# EAGLE design untitled (EAGLE 6.4)
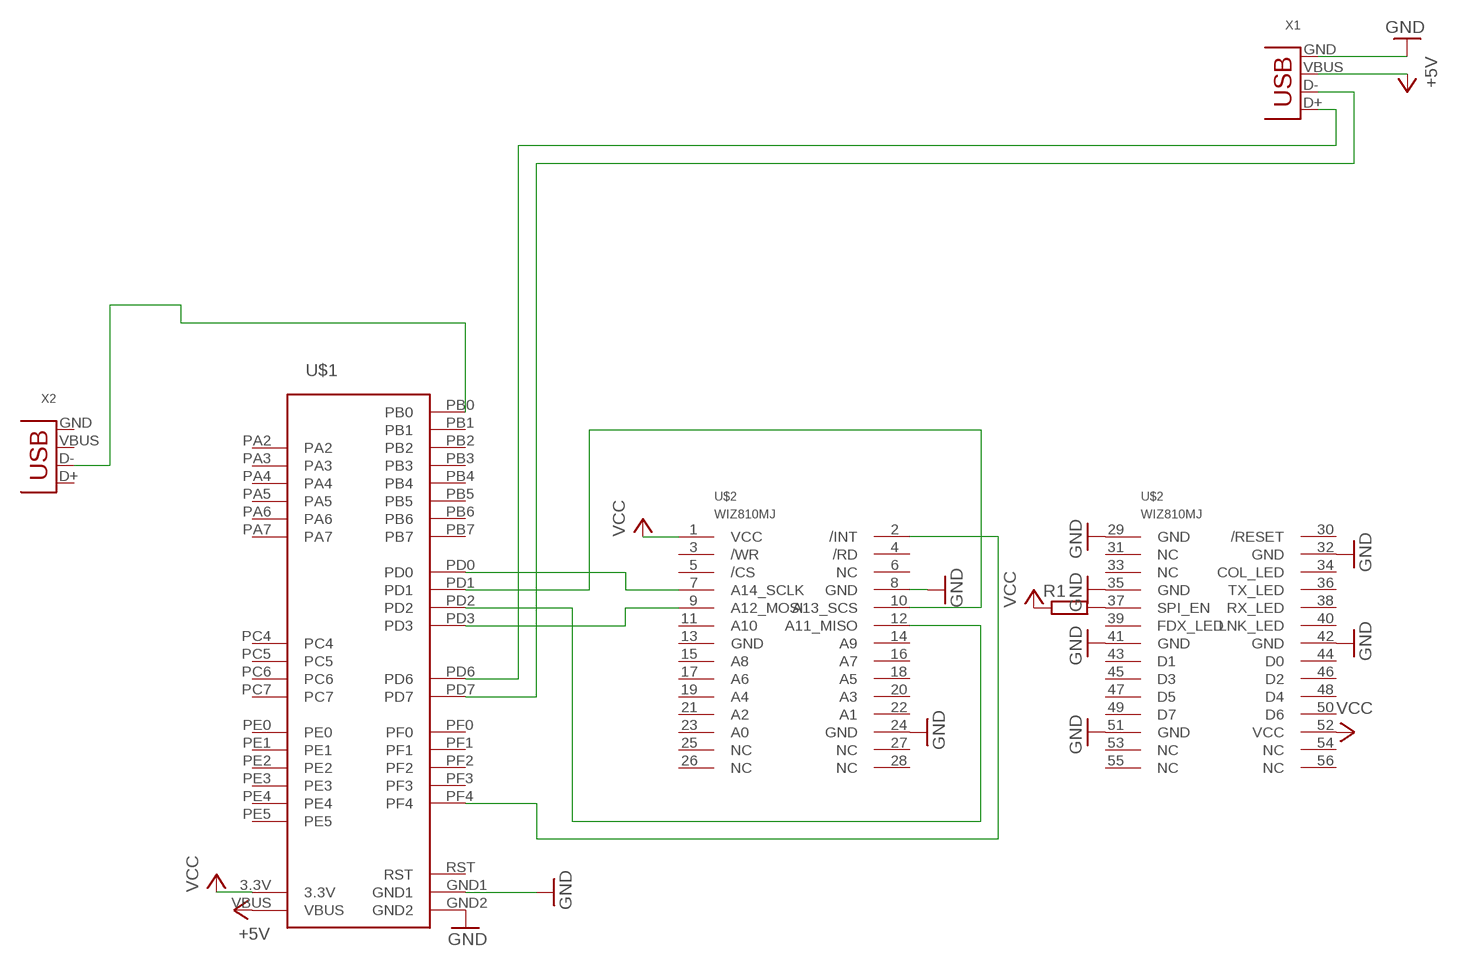
[diagram p0: schematic, sheet 1]

## Parts
R1  R-EU_0204/5  [0204/5]
U$1  STELLARIS-LAUNCHPADSTELLARIS-LAUNCHPAD-XL  [LAUNCHPAD-XL]
U$2  WIZ810MJ  [WIZ810MJ]
X1  USB-A-H  [USB-A-H]
X2  USB-A-H  [USB-A-H]

## Nets
+5V: U$1.VBUS X1.VBUS
GND: U$1.GND1 U$1.GND2 U$2.8(GND) U$2.24(GND) U$2.29(GND) U$2.32(GND) U$2.35(GND) U$2.41(GND) U$2.42(GND) U$2.51(GND) X1.GND
N$1: U$1.PD0 U$2.7(A14_SCLK)
N$2: R1.2 U$2.37(SPI_EN)
N$3: U$1.PD3 U$2.9(A12_MOSI)
N$4: U$1.PD2 U$2.12(A11_MISO)
N$5: U$1.PD1 U$2.10(A13_SCS)
N$6: U$1.PF4 U$2.2(/INT)
N$7: U$1.PD6 X1.D+
N$8: U$1.PD7 X1.D-
N$9: U$1.PB0 X2.D-
VCC: R1.1 U$1.3.3V U$2.1(VCC) U$2.52(VCC)
Unconnected: U$1.PA2 U$1.PA3 U$1.PA4 U$1.PA5 U$1.PA6 U$1.PA7 U$1.PB1 U$1.PB2 U$1.PB3 U$1.PB4 U$1.PB5 U$1.PB6 U$1.PB7 U$1.PC4 U$1.PC5 U$1.PC6 U$1.PC7 U$1.PE0 U$1.PE1 U$1.PE2 U$1.PE3 U$1.PE4 U$1.PE5 U$1.PF0 U$1.PF1 U$1.PF2 U$1.PF3 U$2.3(/WR) U$2.4(/RD) U$2.5(/CS) U$2.6(NC) U$2.11(A10) U$2.13(GND) U$2.14(A9) U$2.15(A8) U$2.16(A7) U$2.17(A6) U$2.18(A5) U$2.19(A4) U$2.20(A3) U$2.21(A2) U$2.22(A1) U$2.23(A0) U$2.25(NC) U$2.26(NC) U$2.27(NC) U$2.28(NC) U$2.30(/RESET) U$2.31(NC) U$2.33(NC) U$2.34(COL_LED) U$2.36(TX_LED) U$2.38(RX_LED) U$2.39(FDX_LED) U$2.40(LNK_LED) U$2.43(D1) U$2.44(D0) U$2.45(D3) U$2.46(D2) U$2.47(D5) U$2.48(D4) U$2.49(D7) U$2.50(D6) U$2.53(NC) U$2.54(NC) U$2.55(NC) U$2.56(NC) X2.D+ X2.GND X2.VBUS

## Power pins joined to a net without a drawn wire
RST: U$1.RST

## Library data of the parts
R1 = resistor:R-EU_: RESISTOR, European symbol
U$1 = StellarisLaunchPad_Fred:STELLARIS-LAUNCHPAD
U$2 = WIZNET:WIZ810MJ
X1 X2 = lieven:USB: USB Connectors

## Board
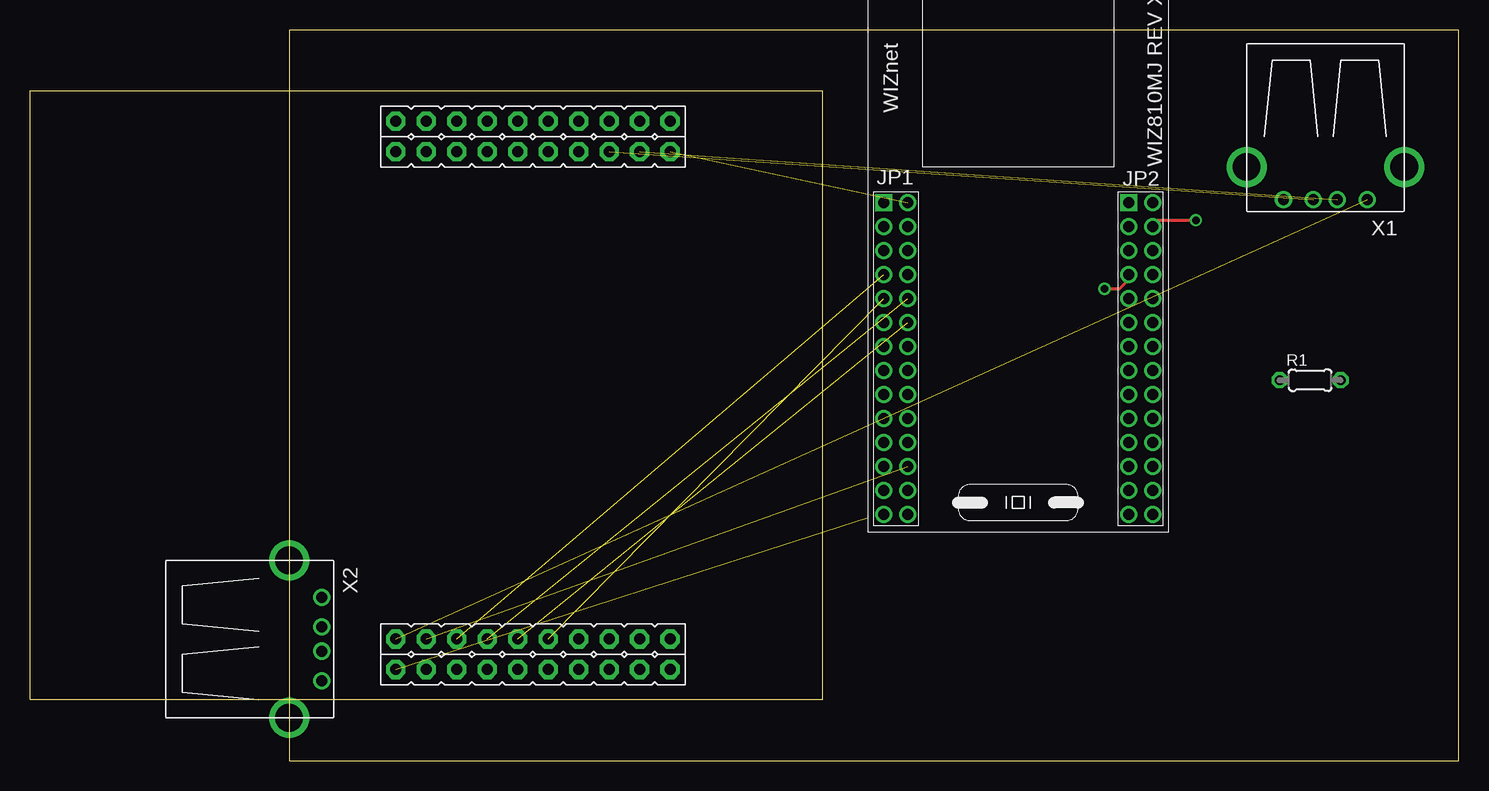
[diagram p1: board, top side]
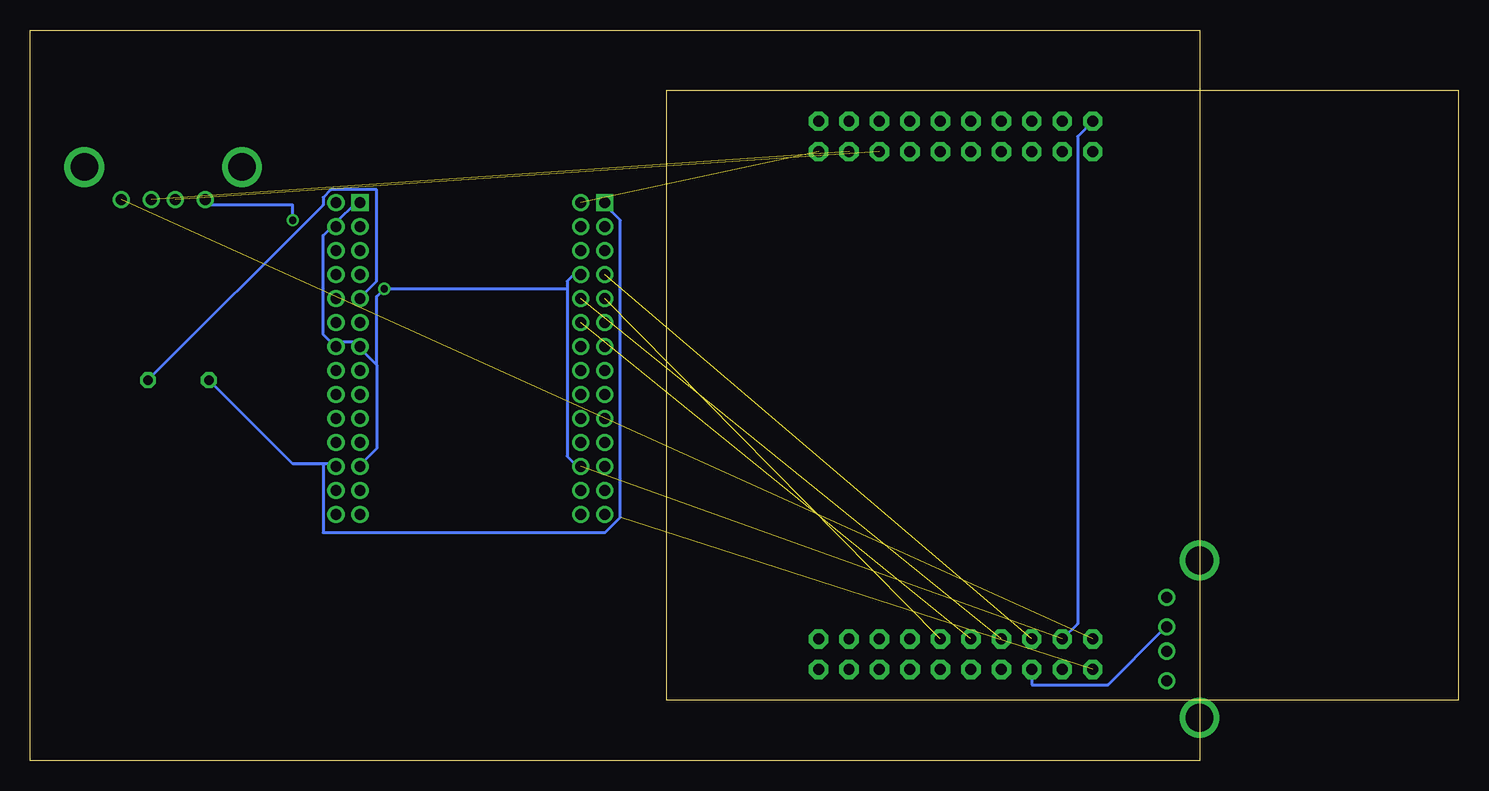
[diagram p2: board, bottom side, seen from below]

Size 97.46 x 60.95 mm. Coordinates in mm from the lower left corner, seen from the top.
Outline: 0,0 97.46,0 97.46,60.95 0,60.95 0,0
Copper layers (1*16): Top 0.035mm / dielectric 1.5mm / Bottom 0.035mm
Design rules "default": minimum track width 10mil, minimum drill 24mil, track to track 8mil, track to pad 8mil, pad to pad 8mil, via to via 8mil, smd to smd 8mil, copper to edge 40mil, drill to drill 8mil, minimum pad ring 10mil, minimum via ring 8mil, stop-mask expansion 4mil, vias tented up to drill 0mil, thermal gap 10mil

### Footprints (pad centres in the part's own frame; a part is rotated, then mirrored left to right if it is on the bottom)
0204/5 = drill 0.813 octagon: 1 -2.54,0; 2 2.54,0
LAUNCHPAD-XL = drill 0.914 pad 1.6 octagon: 3.3V 30.48,2.54; GND1 33.02,5.08; GND2 30.48,48.26; PA2 53.34,48.26; PA3 50.8,48.26; PA4 48.26,48.26; PA5 48.26,2.54; PA6 50.8,2.54; PA7 53.34,2.54; PB0 35.56,2.54; PB1 38.1,2.54; PB2 33.02,48.26; PB3 35.56,45.72; PB4 45.72,2.54; PB5 33.02,2.54; PB6 45.72,48.26; PB7 43.18,48.26; PC4 38.1,45.72; PC5 40.64,45.72; PC6 43.18,45.72; PC7 45.72,45.72; PD0 35.56,5.08; PD1 38.1,5.08; PD2 40.64,5.08; PD3 43.18,5.08; PD6 48.26,45.72; PD7 50.8,45.72; PE0 35.56,48.26; PE1 45.72,5.08; PE2 48.26,5.08; PE3 50.8,5.08; PE4 40.64,2.54; PE5 43.18,2.54; PF0 38.1,48.26; PF1 53.34,5.08; PF2 30.48,45.72; PF3 33.02,45.72; PF4 53.34,45.72; RST 40.64,48.26; VBUS 30.48,5.08
WIZ810MJ = drill 0.9 pad 1.422 square: 1 27.5,-1.3; 29 27.5,-21.7 | drill 0.9 pad 1.422: 2 27.5,-3.3; 3 25.5,-1.3; 4 25.5,-3.3; 5 23.5,-1.3; 6 23.5,-3.3; 7 21.5,-1.3; 8 21.5,-3.3; 9 19.5,-1.3; 10 19.5,-3.3; 11 17.5,-1.3; 12 17.5,-3.3; 13 15.5,-1.3; 14 15.5,-3.3; 15 13.5,-1.3; 16 13.5,-3.3; 17 11.5,-1.3; 18 11.5,-3.3; 19 9.5,-1.3; 20 9.5,-3.3; 21 7.5,-1.3; 22 7.5,-3.3; 23 5.5,-1.3; 24 5.5,-3.3; 25 3.5,-1.3; 26 3.5,-3.3; 27 1.5,-1.3; 28 1.5,-3.3; 30 27.5,-23.7; 31 25.5,-21.7; 32 25.5,-23.7; 33 23.5,-21.7; 34 23.5,-23.7; 35 21.5,-21.7; 36 21.5,-23.7; 37 19.5,-21.7; 38 19.5,-23.7; 39 17.5,-21.7; 40 17.5,-23.7; 41 15.5,-21.7; 42 15.5,-23.7; 43 13.5,-21.7; 44 13.5,-23.7; 45 11.5,-21.7; 46 11.5,-23.7; 47 9.5,-21.7; 48 9.5,-23.7; 49 7.5,-21.7; 50 7.5,-23.7; 51 5.5,-21.7; 52 5.5,-23.7; 53 3.5,-21.7; 54 3.5,-23.7; 55 1.5,-21.7; 56 1.5,-23.7
USB-A-H = drill 0.914: D+ 2.718,-1.003; D- 2.718,1.003; GND 2.718,-3.493; VBUS 2.718,3.493 | drill 2.311: P$5 0,-6.566; P$6 0,6.566

### Placement (x,y rotation side)
R1  85.09,31.75 0 top
U$1  -21.59,5.08 0 top
U$2  48.26,19.05 90 top
X1  86.36,49.53 270 top
X2  0,10.16 0 top

### Tracks (layer width: path | path; a pad name or v marks a point on that pad's centre or on a via)
+5V  (1 unrouted)
GND  (via drill 0.61)  (1 unrouted)
  Top 0.254: v75.56,45.09 72.39,45.09 U$2.32 | v67.94,39.37 69.22,39.37 69.85,40.01 U$2.35
  Bottom 0.254: U$1.GND1 10.16,11.43 10.16,52.07 U$1.GND2 | 52.7,39.37 52.7,40.01 52.07,40.64 U$2.8 | 52.7,39.37 52.7,25.4 52.07,24.77 U$2.24 | U$2.29 70.48,46.35 71.75,45.09 U$2.32 72.39,44.45 73.03,43.81 73.03,35.56 72.39,34.92 U$2.42 71.75,34.92 70.48,34.92 U$2.41 69.85,34.29 68.58,33.02 | v75.56,45.09 75.56,46.35 82.55,46.35 X1.GND | 68.58,33.02 68.58,26.04 69.85,24.77 U$2.51 | 68.58,33.02 68.58,38.73 v67.94,39.37 52.7,39.37
N$1  (1 unrouted)
N$2
  Bottom 0.254: R1.2 73.03,46.35 73.03,46.99 72.39,47.62 68.58,47.62 68.58,40.01 69.85,38.73 U$2.37
N$3  (1 unrouted)
N$4  (1 unrouted)
N$5  (1 unrouted)
N$6  (1 unrouted)
N$7  (1 unrouted)
N$8  (1 unrouted)
N$9
  Bottom 0.254: U$1.PB0 13.97,6.35 7.62,6.35 3.17,10.79 X2.D-
VCC  (1 unrouted)
  Bottom 0.254: R1.1 75.56,24.77 73.03,24.77 | 73.03,24.77 72.39,24.77 U$2.52 | 73.03,24.77 73.03,19.05 49.53,19.05 48.26,20.32 48.26,45.09 49.53,46.35 U$2.1